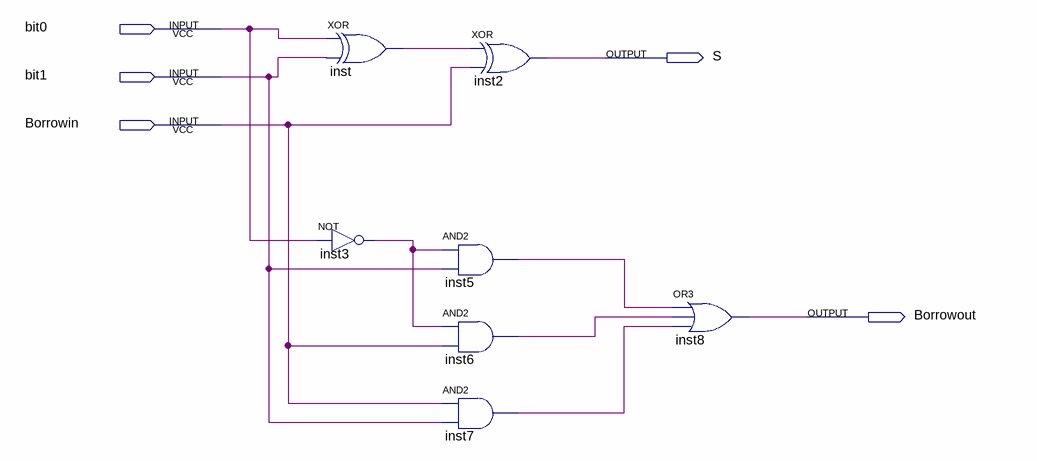
[diagram p0: schematic sheet]
// Quartus schematic aula07.bdf as structural Verilog: 7 symbols, 5 pins
module aula07 (
  input  bit0,
  input  bit1,
  input  Borrowin,
  output S,
  output Borrowout
);

  wire inst3_out, inst5_out, inst6_out, inst7_out, inst_out;

  xor inst (inst_out, bit0, bit1);
  not inst3 (inst3_out, bit0);
  xor inst2 (S, inst_out, Borrowin);
  and inst5 (inst5_out, inst3_out, bit1);
  and inst6 (inst6_out, inst3_out, Borrowin);
  and inst7 (inst7_out, Borrowin, bit1);
  or inst8 (Borrowout, inst5_out, inst6_out, inst7_out);
endmodule
